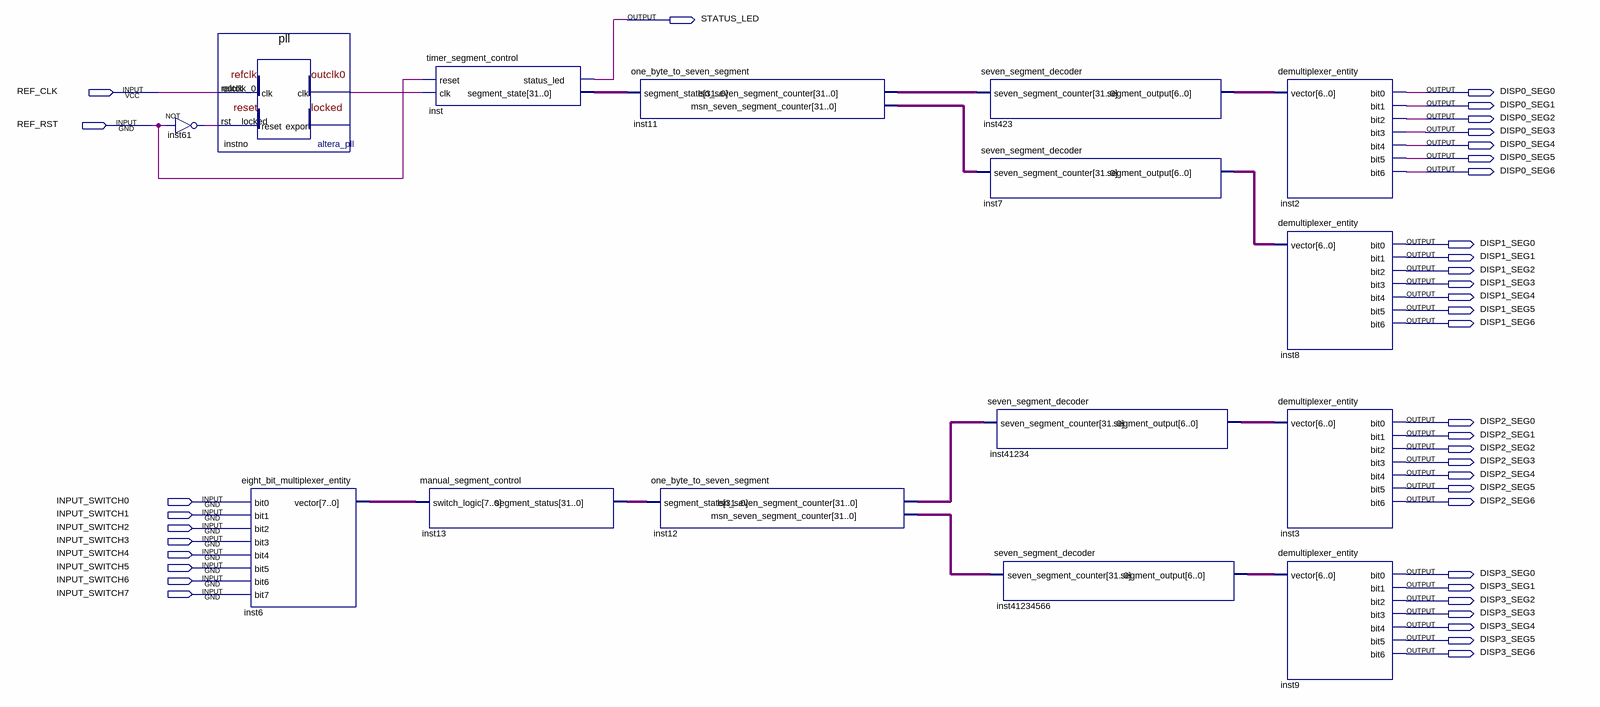
[diagram p0: schematic sheet]
// Quartus schematic project3-7-segment.bdf as structural Verilog: 15 symbols, 39 pins
module \project3-7-segment  (
  input  REF_CLK,
  input  REF_RST,
  input  INPUT_SWITCH0,
  input  INPUT_SWITCH1,
  input  INPUT_SWITCH2,
  input  INPUT_SWITCH3,
  input  INPUT_SWITCH4,
  input  INPUT_SWITCH5,
  input  INPUT_SWITCH6,
  input  INPUT_SWITCH7,
  output STATUS_LED,
  output DISP0_SEG0,
  output DISP0_SEG1,
  output DISP0_SEG2,
  output DISP0_SEG3,
  output DISP0_SEG4,
  output DISP0_SEG5,
  output DISP0_SEG6,
  output DISP1_SEG0,
  output DISP1_SEG1,
  output DISP1_SEG2,
  output DISP1_SEG3,
  output DISP1_SEG4,
  output DISP1_SEG5,
  output DISP1_SEG6,
  output DISP2_SEG0,
  output DISP2_SEG1,
  output DISP2_SEG2,
  output DISP2_SEG3,
  output DISP2_SEG4,
  output DISP2_SEG5,
  output DISP2_SEG6,
  output DISP3_SEG0,
  output DISP3_SEG1,
  output DISP3_SEG2,
  output DISP3_SEG3,
  output DISP3_SEG4,
  output DISP3_SEG5,
  output DISP3_SEG6
);

  wire inst61_out, instno_outclk_0;
  wire [6:0] inst7_segment_output, inst423_segment_output, inst41234_segment_output,
       inst41234566_segment_output;
  wire [7:0] inst6_vector;
  wire [31:0] inst11_lsn_seven_segment_counter, inst11_msn_seven_segment_counter,
       inst12_lsn_seven_segment_counter, inst12_msn_seven_segment_counter, inst13_segment_status,
       inst_segment_state;

  not inst61 (inst61_out, REF_RST);
  pll instno (.refclk(REF_CLK), .rst(inst61_out), .outclk_0(instno_outclk_0));  // open: locked
  eight_bit_multiplexer_entity inst6 (
    .bit0(INPUT_SWITCH0), .bit1(INPUT_SWITCH1), .bit2(INPUT_SWITCH2), .bit3(INPUT_SWITCH3),
    .bit4(INPUT_SWITCH4), .bit5(INPUT_SWITCH5), .bit6(INPUT_SWITCH6), .bit7(INPUT_SWITCH7),
    .vector(inst6_vector));
  timer_segment_control inst (
    .reset(REF_RST), .clk(instno_outclk_0), .status_led(STATUS_LED), .segment_state(inst_segment_state));
  manual_segment_control inst13 (.switch_logic(inst6_vector), .segment_status(inst13_segment_status));
  one_byte_to_seven_segment inst11 (
    .segment_state(inst_segment_state), .lsn_seven_segment_counter(inst11_lsn_seven_segment_counter),
    .msn_seven_segment_counter(inst11_msn_seven_segment_counter));
  one_byte_to_seven_segment inst12 (
    .segment_state(inst13_segment_status), .lsn_seven_segment_counter(inst12_lsn_seven_segment_counter),
    .msn_seven_segment_counter(inst12_msn_seven_segment_counter));
  seven_segment_decoder inst423 (
    .seven_segment_counter(inst11_lsn_seven_segment_counter), .segment_output(inst423_segment_output));
  seven_segment_decoder inst7 (
    .seven_segment_counter(inst11_msn_seven_segment_counter), .segment_output(inst7_segment_output));
  seven_segment_decoder inst41234 (
    .seven_segment_counter(inst12_lsn_seven_segment_counter), .segment_output(inst41234_segment_output));
  seven_segment_decoder inst41234566 (
    .seven_segment_counter(inst12_msn_seven_segment_counter), .segment_output(inst41234566_segment_output));
  demultiplexer_entity inst2 (
    .vector(inst423_segment_output), .bit0(DISP0_SEG0), .bit1(DISP0_SEG1), .bit2(DISP0_SEG2),
    .bit3(DISP0_SEG3), .bit4(DISP0_SEG4), .bit5(DISP0_SEG5), .bit6(DISP0_SEG6));
  demultiplexer_entity inst8 (
    .vector(inst7_segment_output), .bit0(DISP1_SEG0), .bit1(DISP1_SEG1), .bit2(DISP1_SEG2),
    .bit3(DISP1_SEG3), .bit4(DISP1_SEG4), .bit5(DISP1_SEG5), .bit6(DISP1_SEG6));
  demultiplexer_entity inst3 (
    .vector(inst41234_segment_output), .bit0(DISP2_SEG0), .bit1(DISP2_SEG1), .bit2(DISP2_SEG2),
    .bit3(DISP2_SEG3), .bit4(DISP2_SEG4), .bit5(DISP2_SEG5), .bit6(DISP2_SEG6));
  demultiplexer_entity inst9 (
    .vector(inst41234566_segment_output), .bit0(DISP3_SEG0), .bit1(DISP3_SEG1), .bit2(DISP3_SEG2),
    .bit3(DISP3_SEG3), .bit4(DISP3_SEG4), .bit5(DISP3_SEG5), .bit6(DISP3_SEG6));
endmodule
